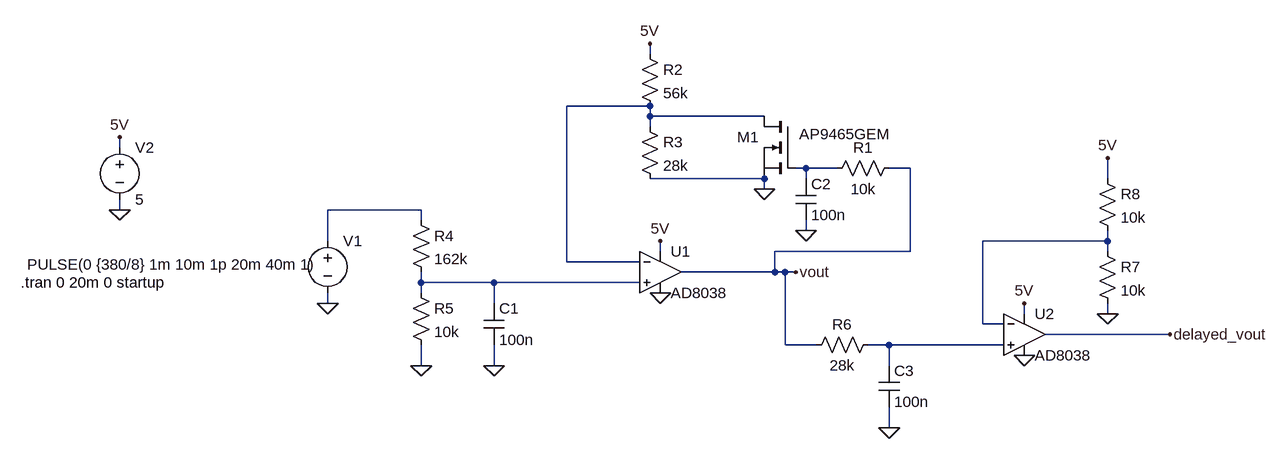
[diagram p0: schematic latched_delay.asc]
latched_delay.asc, the LTspice schematic file:
Version 4.1
SHEET 1 1428 680
WIRE 432 -160 432 -176
WIRE 432 -80 304 -80
WIRE 432 -64 432 -80
WIRE 608 -64 432 -64
WIRE 432 -48 432 -64
WIRE -384 -16 -384 -32
WIRE 672 16 656 16
WIRE 720 16 672 16
WIRE 832 16 800 16
WIRE 608 32 432 32
WIRE 672 32 672 16
WIRE 1136 32 1136 0
WIRE 608 48 608 32
WIRE -384 80 -384 64
WIRE 80 80 -64 80
WIRE 80 96 80 80
WIRE 672 112 672 96
WIRE -64 128 -64 80
WIRE 1136 128 1136 112
WIRE 1136 128 944 128
WIRE 448 144 448 128
WIRE 832 144 832 16
WIRE 832 144 624 144
WIRE 1136 144 1136 128
WIRE 304 160 304 -80
WIRE 416 160 304 160
WIRE 624 176 624 144
WIRE 624 176 480 176
WIRE 640 176 624 176
WIRE 656 176 640 176
WIRE 80 192 80 176
WIRE 192 192 80 192
WIRE 416 192 192 192
WIRE 80 208 80 192
WIRE -64 224 -64 208
WIRE 192 224 192 192
WIRE 1008 240 1008 224
WIRE 1136 240 1136 224
WIRE 944 256 944 128
WIRE 976 256 944 256
WIRE 1232 272 1040 272
WIRE 640 288 640 176
WIRE 688 288 640 288
WIRE 800 288 768 288
WIRE 976 288 800 288
WIRE 80 320 80 288
WIRE 192 320 192 288
WIRE 800 320 800 288
WIRE 800 416 800 384
FLAG 448 208 0
FLAG 448 128 5V
FLAG -384 80 0
FLAG -384 -32 5V
FLAG 192 320 0
FLAG 656 176 vout
FLAG 608 48 0
FLAG 432 -176 5V
FLAG -64 224 0
FLAG 80 320 0
FLAG 672 112 0
FLAG 1008 304 0
FLAG 1008 224 5V
FLAG 800 416 0
FLAG 1136 240 0
FLAG 1136 0 5V
FLAG 1232 272 delayed_vout
SYMBOL voltage -384 -32 R0
WINDOW 123 0 0 Left 0
WINDOW 39 0 0 Left 0
SYMATTR InstName V2
SYMATTR Value 5
SYMBOL OpAmps\\AD8038 448 112 R0
SYMATTR InstName U1
SYMBOL cap 176 224 R0
SYMATTR InstName C1
SYMATTR Value 100n
SYMBOL res 416 -176 R0
SYMATTR InstName R2
SYMATTR Value 56k
SYMBOL res 416 -64 R0
SYMATTR InstName R3
SYMATTR Value 28k
SYMBOL nmos 656 -64 M0
WINDOW 3 -146 27 Left 2
SYMATTR Value AP9465GEM
SYMATTR InstName M1
SYMBOL voltage -64 112 R0
WINDOW 3 -462 52 Left 2
WINDOW 123 0 0 Left 0
WINDOW 39 0 0 Left 0
SYMATTR Value PULSE(0 {380/8} 1m 10m 1p 20m 40m 1)
SYMATTR InstName V1
SYMBOL res 64 80 R0
SYMATTR InstName R4
SYMATTR Value 162k
SYMBOL res 64 192 R0
SYMATTR InstName R5
SYMATTR Value 10k
SYMBOL res 816 0 R90
WINDOW 0 0 56 VBottom 2
WINDOW 3 32 56 VTop 2
SYMATTR InstName R1
SYMATTR Value 10k
SYMBOL cap 656 32 R0
SYMATTR InstName C2
SYMATTR Value 100n
SYMBOL OpAmps\\AD8038 1008 208 R0
SYMATTR InstName U2
SYMBOL res 784 272 R90
WINDOW 0 0 56 VBottom 2
WINDOW 3 32 56 VTop 2
SYMATTR InstName R6
SYMATTR Value 28k
SYMBOL cap 784 320 R0
SYMATTR InstName C3
SYMATTR Value 100n
SYMBOL res 1120 128 R0
SYMATTR InstName R7
SYMATTR Value 10k
SYMBOL res 1120 16 R0
SYMATTR InstName R8
SYMATTR Value 10k
TEXT -536 192 Left 2 !.tran 0 20m 0 startup

The netlist it stands for:
* latched_delay.asc
V2 5V 0 5
X§U1 N005 N001 5V 0 vout AD8038  ; pins In+ In- V+ V- OUT
C1 N005 0 100n
R2 5V N001 56k
R3 N001 0 28k
M1 N001 N002 0 0 AP9465GEM
V1 N003 0 PULSE(0 {380/8} 1m 10m 1p 20m 40m 1)
R4 N003 N005 162k
R5 N005 0 10k
R1 vout N002 10k
C2 N002 0 100n
X§U2 N006 N004 5V 0 delayed_vout AD8038  ; pins In+ In- V+ V- OUT
R6 N006 vout 28k
C3 N006 0 100n
R7 N004 0 10k
R8 5V N004 10k
.model NMOS NMOS
.model PMOS PMOS
.lib standard.mos
.tran 0 20m 0 startup
.backanno
.end